# EAGLE schematic Sturingsschakeling_schema_v5.0 (EAGLE 9.7.0)
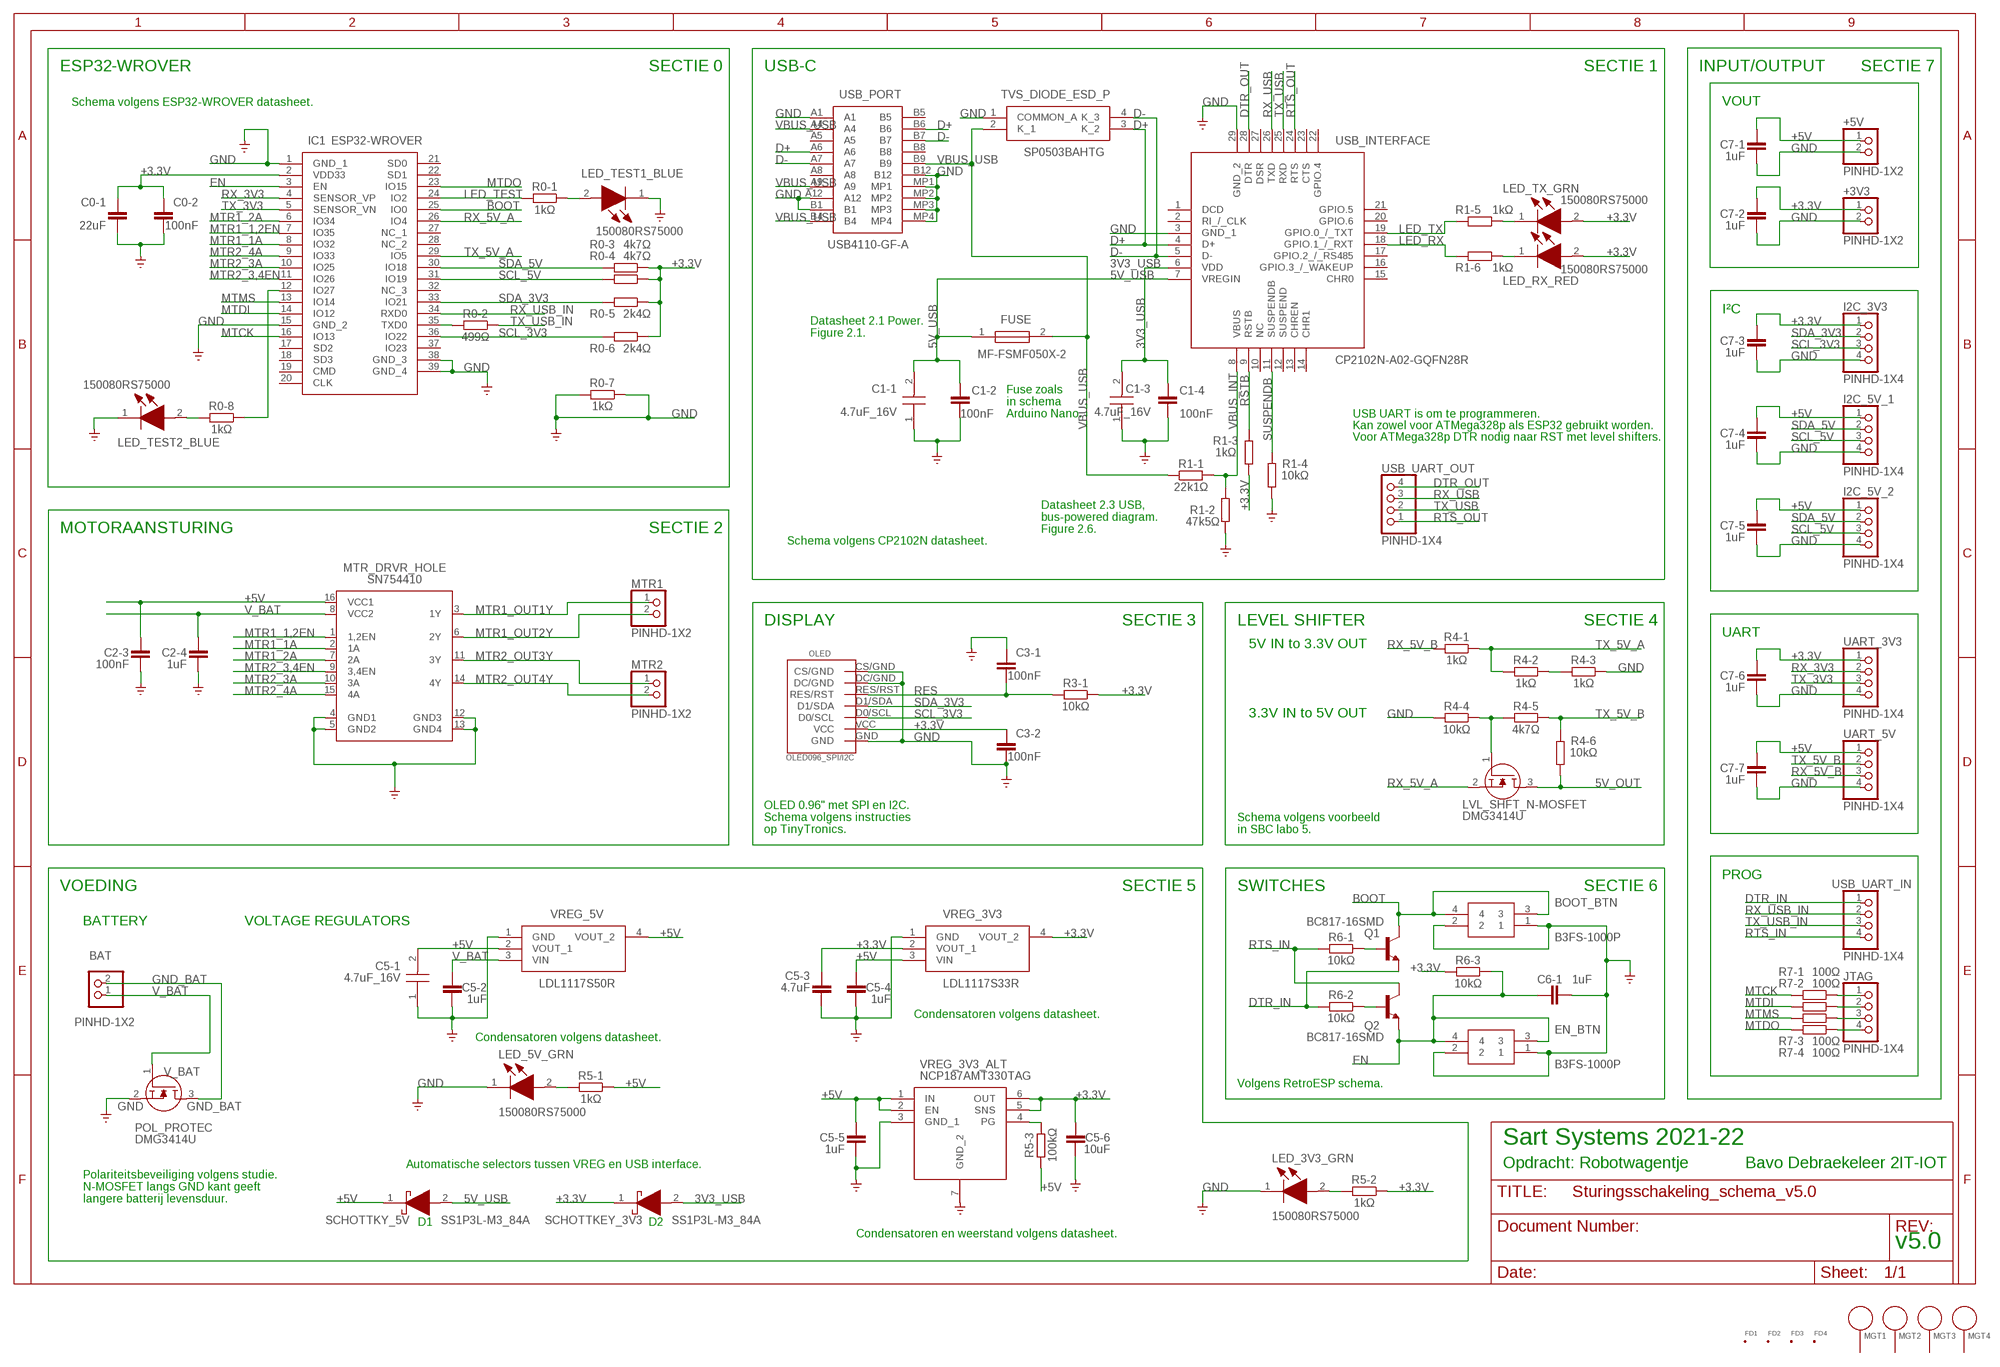
[diagram p0: schematic, sheet 1]

## Parts
+3V3  PINHD-1X2  [1X02]
+5V  PINHD-1X2  [1X02]
BAT  PINHD-1X2  [1X02]
BOOT_BTN  B3FS-1000P  [B3FS-1000P]
C0-1  22uF  C_CHIP-0805(2012-METRIC)  [CAPC2012X110]
C0-2  100nF  C_CHIP-0805(2012-METRIC)  [CAPC2012X110]
C1-1  4.7uF_16V  CC0805ZKY5V7BB475  [CAPC2012X145N]
C1-2  100nF  C_CHIP-0805(2012-METRIC)  [CAPC2012X110]
C1-3  4.7uF_16V  CC0805ZKY5V7BB475  [CAPC2012X145N]
C1-4  100nF  C_CHIP-0805(2012-METRIC)  [CAPC2012X110]
C2-3  100nF  C_CHIP-0805(2012-METRIC)  [CAPC2012X110]
C2-4  1uF  C_CHIP-0805(2012-METRIC)  [CAPC2012X110]
C3-1  100nF  C_CHIP-0805(2012-METRIC)  [CAPC2012X110]
C3-2  100nF  C_CHIP-0805(2012-METRIC)  [CAPC2012X110]
C5-1  4.7uF_16V  CC0805ZKY5V7BB475  [CAPC2012X145N]
C5-2  1uF  C_CHIP-0805(2012-METRIC)  [CAPC2012X110]
C5-3  4.7uF  C_CHIP-0805(2012-METRIC)  [CAPC2012X110]
C5-4  1uF  C_CHIP-0805(2012-METRIC)  [CAPC2012X110]
C5-5  1uF  C_CHIP-0805(2012-METRIC)  [CAPC2012X110]
C5-6  10uF  C_CHIP-0805(2012-METRIC)  [CAPC2012X110]
C6-1  1uF  C_CHIP-0805(2012-METRIC)  [CAPC2012X110]
C7-1  1uF  C_CHIP-0805(2012-METRIC)  [CAPC2012X110]
C7-2  1uF  C_CHIP-0805(2012-METRIC)  [CAPC2012X110]
C7-3  1uF  C_CHIP-0805(2012-METRIC)  [CAPC2012X110]
C7-4  1uF  C_CHIP-0805(2012-METRIC)  [CAPC2012X110]
C7-5  1uF  C_CHIP-0805(2012-METRIC)  [CAPC2012X110]
C7-6  1uF  C_CHIP-0805(2012-METRIC)  [CAPC2012X110]
C7-7  1uF  C_CHIP-0805(2012-METRIC)  [CAPC2012X110]
EN_BTN  B3FS-1000P  [B3FS-1000P]
FD1  FID_60MIL_P  [FID_060_P]
FD2  FID_60MIL_P  [FID_060_P]
FD3  FID_60MIL_P  [FID_060_P]
FD4  FID_60MIL_P  [FID_060_P]
FUSE  MF-FSMF050X-2  [FUSC1608X100N]
I2C_3V3  PINHD-1X4  [1X04]
I2C_5V_1  PINHD-1X4  [1X04]
I2C_5V_2  PINHD-1X4  [1X04]
IC1  ESP32-WROVER  [ESP32WROVER]
JTAG  PINHD-1X4  [1X04]
LED_3V3_GRN  150080RS75000  [LEDC2012X80N]
LED_5V_GRN  150080RS75000  [LEDC2012X80N]
LED_RX_RED  150080RS75000  [LEDC2012X80N]
LED_TEST1_BLUE  150080RS75000  [LEDC2012X80N]
LED_TEST2_BLUE  150080RS75000  [LEDC2012X80N]
LED_TX_GRN  150080RS75000  [LEDC2012X80N]
LVL_SHFT_N-MOSFET  DMG3414U  [SOT96P240X110-3N]
MGT1  BEAGLEBONEBLACK_MOUNTING_HOLE  [BEAGLEBONEBLACK_MOUNTING_HOLE]
MGT2  BEAGLEBONEBLACK_MOUNTING_HOLE  [BEAGLEBONEBLACK_MOUNTING_HOLE]
MGT3  BEAGLEBONEBLACK_MOUNTING_HOLE  [BEAGLEBONEBLACK_MOUNTING_HOLE]
MGT4  BEAGLEBONEBLACK_MOUNTING_HOLE  [BEAGLEBONEBLACK_MOUNTING_HOLE]
MTR1  PINHD-1X2  [1X02]
MTR2  PINHD-1X2  [1X02]
MTR_DRVR_HOLE  SN754410  [DIP762W53P254L1980H508Q16B]
OLED  OLED096_SPI/I2C  [OLED096_SPI/I2C]
POL_PROTEC  DMG3414U  [SOT96P240X110-3N]
Q1  BC817-16SMD  [SOT23-BEC]
Q2  BC817-16SMD  [SOT23-BEC]
R0-1  1kΩ  R_CHIP-0805(2012-METRIC)  [RESC2012X65]
R0-2  499Ω  R_CHIP-0805(2012-METRIC)  [RESC2012X65]
R0-3  4k7Ω  R_CHIP-0805(2012-METRIC)  [RESC2012X65]
R0-4  4k7Ω  R_CHIP-0805(2012-METRIC)  [RESC2012X65]
R0-5  2k4Ω  R_CHIP-0805(2012-METRIC)  [RESC2012X65]
R0-6  2k4Ω  R_CHIP-0805(2012-METRIC)  [RESC2012X65]
R0-7  1kΩ  R_CHIP-0805(2012-METRIC)  [RESC2012X65]
R0-8  1kΩ  R_CHIP-0805(2012-METRIC)  [RESC2012X65]
R1-1  22k1Ω  R_CHIP-0805(2012-METRIC)  [RESC2012X65]
R1-2  47k5Ω  R_CHIP-0805(2012-METRIC)  [RESC2012X65]
R1-3  1kΩ  R_CHIP-0805(2012-METRIC)  [RESC2012X65]
R1-4  10kΩ  R_CHIP-0805(2012-METRIC)  [RESC2012X65]
R1-5  1kΩ  R_CHIP-0805(2012-METRIC)  [RESC2012X65]
R1-6  1kΩ  R_CHIP-0805(2012-METRIC)  [RESC2012X65]
R3-1  10kΩ  R_CHIP-0805(2012-METRIC)  [RESC2012X65]
R4-1  1kΩ  R_CHIP-0805(2012-METRIC)  [RESC2012X65]
R4-2  1kΩ  R_CHIP-0805(2012-METRIC)  [RESC2012X65]
R4-3  1kΩ  R_CHIP-0805(2012-METRIC)  [RESC2012X65]
R4-4  10kΩ  R_CHIP-0805(2012-METRIC)  [RESC2012X65]
R4-5  4k7Ω  R_CHIP-0805(2012-METRIC)  [RESC2012X65]
R4-6  10kΩ  R_CHIP-0805(2012-METRIC)  [RESC2012X65]
R5-1  1kΩ  R_CHIP-0805(2012-METRIC)  [RESC2012X65]
R5-2  1kΩ  R_CHIP-0805(2012-METRIC)  [RESC2012X65]
R5-3  100kΩ  R_CHIP-0805(2012-METRIC)  [RESC2012X65]
R6-1  10kΩ  R_CHIP-0805(2012-METRIC)  [RESC2012X65]
R6-2  10kΩ  R_CHIP-0805(2012-METRIC)  [RESC2012X65]
R6-3  10kΩ  R_CHIP-0805(2012-METRIC)  [RESC2012X65]
R7-1  100Ω  R_CHIP-0805(2012-METRIC)  [RESC2012X65]
R7-2  100Ω  R_CHIP-0805(2012-METRIC)  [RESC2012X65]
R7-3  100Ω  R_CHIP-0805(2012-METRIC)  [RESC2012X65]
R7-4  100Ω  R_CHIP-0805(2012-METRIC)  [RESC2012X65]
SCHOTTKEY_3V3  SS1P3L-M3_84A  [SS1P3LM384A]
SCHOTTKY_5V  SS1P3L-M3_84A  [SS1P3LM384A]
TVS_DIODE_ESD_P  SP0503BAHTG  [SP0503BAHTG]
UART_3V3  PINHD-1X4  [1X04]
UART_5V  PINHD-1X4  [1X04]
USB_INTERFACE  CP2102N-A02-GQFN28R  [QFN50P500X500X80-29N]
USB_PORT  USB4110-GF-A  [USB4110GFA]
USB_UART_IN  PINHD-1X4  [1X04]
USB_UART_OUT  PINHD-1X4  [1X04]
VREG_3V3  LDL1117S33R  [SOT230P700X180-4N]
VREG_3V3_ALT  NCP187AMT330TAG  [SON65P200X200X80-7N]
VREG_5V  LDL1117S50R  [SOT230P700X180-4N]

## Nets
3V3_USB: C1-3.2 C1-4.2 SCHOTTKEY_3V3.2(A) USB_INTERFACE.6(VDD)
5V_OUT: LVL_SHFT_N-MOSFET.3(D) R4-6.2
5V_USB: C1-1.2 C1-2.2 FUSE.1 SCHOTTKY_5V.2(A) USB_INTERFACE.7(VREGIN)
+3.3V: +3V3.1 C0-1.2 C0-2.2 C3-2.2 C5-3.2 C5-6.2 C7-2.2 C7-3.2 C7-6.2 I2C_3V3.1 IC1.2(VDD33) LED_RX_RED.2(A) LED_TX_GRN.2(A) OLED.VCC R0-3.1 R0-4.1 R0-5.1 R0-6.1 R1-3.2 R3-1.1 R5-2.1 R6-3.2 SCHOTTKEY_3V3.1(K) UART_3V3.1 VREG_3V3.2(VOUT_1) VREG_3V3.4(VOUT_2) VREG_3V3_ALT.5(SNS) VREG_3V3_ALT.6(OUT)
+5V: +5V.1 C2-3.2 C5-1.2 C5-4.2 C5-5.2 C7-1.2 C7-4.2 C7-5.2 C7-7.2 I2C_5V_1.1 I2C_5V_2.1 MTR_DRVR_HOLE.16(VCC1) R5-1.1 R5-3.2 SCHOTTKY_5V.1(K) UART_5V.1 VREG_3V3.3(VIN) VREG_3V3_ALT.1(IN) VREG_3V3_ALT.2(EN) VREG_5V.2(VOUT_1) VREG_5V.4(VOUT_2)
BOOT: BOOT_BTN.3 BOOT_BTN.4 IC1.25(IO0) Q1.C
D+: TVS_DIODE_ESD_P.3(K_2) USB_INTERFACE.4(D+) USB_PORT.A6 USB_PORT.B6
D-: TVS_DIODE_ESD_P.4(K_3) USB_INTERFACE.5(D-) USB_PORT.A7 USB_PORT.B7
DTR_IN: Q1.E R6-2.2 USB_UART_IN.1
DTR_OUT: USB_INTERFACE.28(DTR) USB_UART_OUT.4
EN: C6-1.2 EN_BTN.3 EN_BTN.4 IC1.3(EN) Q2.E R6-3.1
GND: +3V3.2 +5V.2 BOOT_BTN.1 BOOT_BTN.2 C0-1.1 C0-2.1 C1-1.1 C1-2.1 C1-3.1 C1-4.1 C2-3.1 C2-4.1 C3-1.2 C3-2.1 C5-1.1 C5-2.1 C5-3.1 C5-4.1 C5-5.1 C5-6.1 C6-1.1 C7-1.1 C7-2.1 C7-3.1 C7-4.1 C7-5.1 C7-6.1 C7-7.1 EN_BTN.1 EN_BTN.2 I2C_3V3.4 I2C_5V_1.4 I2C_5V_2.4 IC1.1(GND_1) IC1.15(GND_2) IC1.38(GND_3) IC1.39(GND_4) LED_3V3_GRN.1(K) LED_5V_GRN.1(K) LED_TEST1_BLUE.1(K) LED_TEST2_BLUE.1(K) MTR_DRVR_HOLE.4(GND1) MTR_DRVR_HOLE.5(GND2) MTR_DRVR_HOLE.12(GND3) MTR_DRVR_HOLE.13(GND4) OLED.CS/GND OLED.DC/GND OLED.GND POL_PROTEC.2(S) R0-7.1 R0-7.2 R1-2.1 R1-4.1 R4-3.1 R4-4.2 TVS_DIODE_ESD_P.1(COMMON_A) UART_3V3.4 UART_5V.4 USB_INTERFACE.3(GND_1) USB_INTERFACE.29(GND_2) USB_PORT.A1 USB_PORT.A12 USB_PORT.B1 USB_PORT.B12 USB_PORT.MP1 USB_PORT.MP2 USB_PORT.MP3 USB_PORT.MP4 VREG_3V3.1(GND) VREG_3V3_ALT.3(GND_1) VREG_3V3_ALT.7(GND_2) VREG_5V.1(GND) ; supply symbol labelled SUPPLY0_GND_
GND_BAT: BAT.2 POL_PROTEC.3(D)
LED_RX: R1-6.2 USB_INTERFACE.18(GPIO.1_/_RXT)
LED_TEST: IC1.24(IO2) R0-1.2
LED_TX: R1-5.2 USB_INTERFACE.19(GPIO.0_/_TXT)
MTCK: IC1.16(IO13) R7-1.2
MTDI: IC1.14(IO12) R7-2.2
MTDO: IC1.23(IO15) R7-4.2
MTMS: IC1.13(IO14) R7-3.2
MTR1_1,2EN: IC1.7(IO35) MTR_DRVR_HOLE.1(1,2EN)
MTR1_1A: IC1.8(IO32) MTR_DRVR_HOLE.2(1A)
MTR1_2A: IC1.6(IO34) MTR_DRVR_HOLE.7(2A)
MTR1_OUT1Y: MTR1.1 MTR_DRVR_HOLE.3(1Y)
MTR1_OUT2Y: MTR1.2 MTR_DRVR_HOLE.6(2Y)
MTR2_3,4EN: IC1.11(IO26) MTR_DRVR_HOLE.9(3,4EN)
MTR2_3A: IC1.10(IO25) MTR_DRVR_HOLE.10(3A)
MTR2_4A: IC1.9(IO33) MTR_DRVR_HOLE.15(4A)
MTR2_OUT3Y: MTR2.1 MTR_DRVR_HOLE.11(3Y)
MTR2_OUT4Y: MTR2.2 MTR_DRVR_HOLE.14(4Y)
N$2: IC1.12(IO27) R0-8.1
N$3: LED_TEST2_BLUE.2(A) R0-8.2
N$6: JTAG.1 R7-1.1
N$7: LED_3V3_GRN.2(A) R5-2.2
N$8: LED_5V_GRN.2(A) R5-1.2
N$10: LED_TEST1_BLUE.2(A) R0-1.1
N$11: JTAG.2 R7-2.1
N$13: R5-3.1 VREG_3V3_ALT.4(PG)
N$14: JTAG.3 R7-3.1
N$15: JTAG.4 R7-4.1
N$18: Q1.B R6-1.1
N$19: Q2.B R6-2.1
N$34: LVL_SHFT_N-MOSFET.1(G) R4-4.1 R4-5.2
N$35: R4-2.1 R4-3.2
N$38: IC1.35(TXD0) R0-2.2
N$40: LED_TX_GRN.1(K) R1-5.1
N$41: LED_RX_RED.1(K) R1-6.1
RES: C3-1.1 OLED.RES/RST R3-1.2
RSTB: R1-3.1 USB_INTERFACE.9(RSTB)
RTS_IN: Q2.C R6-1.2 USB_UART_IN.4
RTS_OUT: USB_INTERFACE.24(RTS) USB_UART_OUT.1
RX_3V3: IC1.4(SENSOR_VP) UART_3V3.2
RX_5V_A: IC1.26(IO4) LVL_SHFT_N-MOSFET.2(S)
RX_5V_B: R4-1.2 UART_5V.3
RX_USB: USB_INTERFACE.26(TXD) USB_UART_OUT.3
RX_USB_IN: IC1.34(RXD0) USB_UART_IN.2
SCL_3V3: I2C_3V3.3 IC1.36(IO22) OLED.D0/SCL R0-6.2
SCL_5V: I2C_5V_1.3 I2C_5V_2.3 IC1.31(IO19) R0-4.2
SDA_3V3: I2C_3V3.2 IC1.33(IO21) OLED.D1/SDA R0-5.2
SDA_5V: I2C_5V_1.2 I2C_5V_2.2 IC1.30(IO18) R0-3.2
SUSPENDB: R1-4.2 USB_INTERFACE.11(SUSPENDB)
TX_3V3: IC1.5(SENSOR_VN) UART_3V3.3
TX_5V_A: IC1.29(IO5) R4-1.1 R4-2.2
TX_5V_B: R4-5.1 R4-6.1 UART_5V.2
TX_USB: USB_INTERFACE.25(RXD) USB_UART_OUT.2
TX_USB_IN: R0-2.1 USB_UART_IN.3
V_BAT: BAT.1 C2-4.2 C5-2.2 MTR_DRVR_HOLE.8(VCC2) POL_PROTEC.1(G) VREG_5V.3(VIN)
VBUS_INT: R1-1.2 R1-2.2 USB_INTERFACE.8(VBUS)
VBUS_USB: FUSE.2 R1-1.1 TVS_DIODE_ESD_P.2(K_1) USB_PORT.A4 USB_PORT.A9 USB_PORT.B4 USB_PORT.B9
Unconnected: IC1.17(SD2) IC1.18(SD3) IC1.19(CMD) IC1.20(CLK) IC1.21(SD0) IC1.22(SD1) IC1.27(NC_1) IC1.28(NC_2) IC1.32(NC_3) IC1.37(IO23) MGT1.P$1 MGT2.P$1 MGT3.P$1 MGT4.P$1 USB_INTERFACE.1(DCD) USB_INTERFACE.2(RI_/_CLK) USB_INTERFACE.10(NC) USB_INTERFACE.12(SUSPEND) USB_INTERFACE.13(CHREN) USB_INTERFACE.14(CHR1) USB_INTERFACE.15(CHR0) USB_INTERFACE.16(GPIO.3_/_WAKEUP) USB_INTERFACE.17(GPIO.2_/_RS485) USB_INTERFACE.20(GPIO.6) USB_INTERFACE.21(GPIO.5) USB_INTERFACE.22(GPIO.4) USB_INTERFACE.23(CTS) USB_INTERFACE.27(DSR) USB_PORT.A5 USB_PORT.A8 USB_PORT.B5 USB_PORT.B8

## Notes on the sheet
- ESP32-WROVER | SECTIE 0 | USB-C | SECTIE 1 | INPUT/OUTPUT | SECTIE 7
- Schema volgens ESP32-WROVER datasheet. | VOUT
- I²C
- Datasheet 2.1 Power.
  Figure 2.1.
- Fuse zoals
  in schema
  Arduino Nano.
- USB UART is om te programmeren.
- Kan zowel voor ATMega328p als ESP32 gebruikt worden.
- Voor ATMega328p DTR nodig naar RST met level shifters.
- MOTORAANSTURING | SECTIE 2
- Datasheet 2.3 USB,
  bus-powered diagram.
  Figure 2.6.
- Schema volgens CP2102N datasheet.
- DISPLAY | SECTIE 3 | LEVEL SHIFTER | SECTIE 4
- UART
- 5V IN to 3.3V OUT
- 3.3V IN to 5V OUT
- OLED 0.96" met SPI en I2C.
  Schema volgens instructies
  op TinyTronics.
- Schema volgens voorbeeld 
  in SBC labo 5.
- PROG
- VOEDING | SECTIE 5 | SWITCHES | SECTIE 6
- BATTERY | VOLTAGE REGULATORS
- Condensatoren volgens datasheet.
- Condensatoren volgens datasheet.
- Volgens RetroESP schema.
- Sart Systems 2021-22
- Automatische selectors tussen VREG en USB interface. | Opdracht: Robotwagentje | Bavo Debraekeleer 2IT-IOT
- Polariteitsbeveiliging volgens studie.
  N-MOSFET langs GND kant geeft 
  langere batterij levensduur.
- D1 | D2
- Condensatoren en weerstand volgens datasheet.
- v5.0

## Library data of the parts
+3V3 +5V BAT MTR1 MTR2 = Connector:PINHD-1X2: PIN HEADER; CATEGORY: CONNECTOR; SUB-CATEGORY: PIN-HEADER
BOOT_BTN EN_BTN = B3FS-1000P:B3FS-1000P: Switch Tact,6x6mm,flat act,gen purp,tape Plunger Tactile Switch, SPST-NO 0.05 A@ 24 V dc 0.5mm Source: Datasheet <https://www.omron.co.jp/ecb/products/pdf/b3fs.pdf>; ARROW_PART_NUMBER: B3FS-1000P; ARROW_PRICE-STOCK: https://www.arrow.com/en/products/b3fs-1000p/omron?region=nac; DESCRIPTION: Switch Tact,6x6mm,flat act,gen purp,tape Plunger Tactile Switch, SPST-NO 0.05 A@ 24 V dc 0.5mm; HEIGHT: mm; MANUFACTURER_NAME: Omron Electronics; MANUFACTURER_PART_NUMBER: B3FS-1000P; MOUSER_PART_NUMBER: 653-B3FS-1000P; MOUSER_PRICE-STOCK: https://www.mouser.co.uk/ProductDetail/Omron-Electronics/B3FS-1000P?qs=ImaqFqjHA4k6odVF2%2FXWpQ%3D%3D
C0-1 C0-2 C1-2 C1-4 C2-3 C2-4 C3-1 C3-2 C5-2-C5-6 C6-1 C7-1-C7-7 = Capacitor:C: Capacitor - Generic; CATEGORY: Capacitor
C1-1 C1-3 C5-1 = CC0805ZKY5V7BB475:CC0805ZKY5V7BB475: YAGEO - CC0805ZKY5V7BB475 - SMD Multilayer Ceramic Capacitor, 4.7 F, 16 V, 0805 [2012 Metric], +80%, -20%, Y5V, CC Series Source: Datasheet <https://4donline.ihs.com/images/VipMasterIC/IC/YAGO/YAGO-S-A0004841839/YAGO-S-A0004841839-1.pdf?hkey=6D3A4C79FDBF58556ACFDE234799DDF0>; ARROW_PART_NUMBER: CC0805ZKY5V7BB475; ARROW_PRICE-STOCK: https://www.arrow.com/en/products/cc0805zky5v7bb475/yageo; DESCRIPTION: YAGEO - CC0805ZKY5V7BB475 - SMD Multilayer Ceramic Capacitor, 4.7 F, 16 V, 0805 [2012 Metric], +80%, -20%, Y5V, CC Series; HEIGHT: 1.45mm; MANUFACTURER_NAME: KEMET; MANUFACTURER_PART_NUMBER: CC0805ZKY5V7BB475; MOUSER_PART_NUMBER: 603-CC805ZKY5V7BB475; MOUSER_PRICE-STOCK: https://www.mouser.co.uk/ProductDetail/Yageo/CC0805ZKY5V7BB475?qs=7s%252B3O6pAiyA4wtTM471wUA%3D%3D
FD1-FD4 = Fiducial:FID: Fiducial marks. Top and Bottom copper with stop mask
FUSE = MF-FSMF050X-2:MF-FSMF050X-2: 0603 PTC Resettable Fuses, 6V, 500mA Bourns 0.5A Surface Mount Resettable Fuse, 6 V Source: Datasheet <http://uk.rs-online.com/web/p/products/6927633>; ARROW_PART_NUMBER: MF-FSMF050X-2; ARROW_PRICE-STOCK: https://www.arrow.com/en/products/mf-fsmf050x-2/bourns?region=nac; DESCRIPTION: 0603 PTC Resettable Fuses, 6V, 500mA Bourns 0.5A Surface Mount Resettable Fuse, 6 V; HEIGHT: 1mm; MANUFACTURER_NAME: Bourns; MANUFACTURER_PART_NUMBER: MF-FSMF050X-2; MOUSER_PART_NUMBER: 652-MFFSMF050X-2; MOUSER_PRICE-STOCK: https://www.mouser.co.uk/ProductDetail/Bourns/MF-FSMF050X-2?qs=3QkGRBNOvbrZekaW8Gqm4A%3D%3D
I2C_3V3 I2C_5V_1 I2C_5V_2 JTAG UART_3V3 UART_5V USB_UART_IN USB_UART_OUT = Connector:PINHD-1X4: PIN HEADER; CATEGORY: CONNECTOR; SUB-CATEGORY: PIN-HEADER
IC1 = ESP32-WROVER:ESP32-WROVER: WiFi Modules (802.11) SMD Module, ESP32-D0WDQ6, 64Mbits PSRAM, 32Mbits SPI flash, PCB Antenna Source: Datasheet <https://www.mouser.it/datasheet/2/891/esp32-wrover_datasheet_en-1223875.pdf>; DESCRIPTION: WiFi Modules (802.11) SMD Module, ESP32-D0WDQ6, 64Mbits PSRAM, 32Mbits SPI flash, PCB Antenna; HEIGHT: 3mm; MANUFACTURER_NAME: Espressif Systems; MANUFACTURER_PART_NUMBER: ESP32-WROVER; MOUSER_PART_NUMBER: 356-ESP32-WROVER
LED_3V3_GRN LED_5V_GRN LED_RX_RED LED_TEST1_BLUE LED_TEST2_BLUE LED_TX_GRN = 150080RS75000:150080RS75000: LED,Wurth Elektronik,150080RS75000 Wurth Elektronik 150080RS75000, WL-SMCW Series Red LED, 625 nm 2012 (0805) Clear, Rectangle Lens SMD package Source: Datasheet <https://componentsearchengine.com/Datasheets/2/150080RS75000.pdf>; DESCRIPTION: LED,Wurth Elektronik,150080RS75000 Wurth Elektronik 150080RS75000, WL-SMCW Series Red LED, 625 nm 2012 (0805) Clear, Rectangle Lens SMD package; HEIGHT: 0.8mm; MANUFACTURER_NAME: Wurth Elektronik; MANUFACTURER_PART_NUMBER: 150080RS75000; MOUSER_PART_NUMBER: 710-150080RS75000; MOUSER_PRICE-STOCK: https://www.mouser.co.uk/ProductDetail/Wurth-Elektronik/150080RS75000?qs=LlUlMxKIyB2jdCo7bnfgew%3D%3D
LVL_SHFT_N-MOSFET POL_PROTEC = DMG3414U:DMG3414U: DIODES INC. - DMG3414U - MOSFET, N CH, W DIODE, 20V, 4.2A, SOT23 Source: Datasheet <https://componentsearchengine.com/Datasheets/2/DMG3414U.pdf>; DESCRIPTION: DIODES INC. - DMG3414U - MOSFET, N CH, W DIODE, 20V, 4.2A, SOT23; HEIGHT: 1.1mm; MANUFACTURER_NAME: Diodes Inc.; MANUFACTURER_PART_NUMBER: DMG3414U; MOUSER_PART_NUMBER: N/A; MOUSER_PRICE-STOCK: https://www.mouser.co.uk/ProductDetail/Diodes-Incorporated/DMG3414U?qs=Ledwo0gu0jiKJ4xsXSUnyQ%3D%3D
MGT1-MGT4 = BeagleBone_Black_Wireless:BEAGLEBONEBLACK_MOUNTING_HOLE: Chassis Mounting Hole w/GND connection ability
MTR_DRVR_HOLE = IC_Power-Management:SN754410: Quadruple Half-H Driver Datasheet <https://www.ti.com/lit/ds/symlink/sn754410.pdf?ts=1613019217967&ref_url=https%253A%252F%252Fwww.ti.com%252Fproduct%252FSN754410%253Fqgpn%253Dsn754410>; CATEGORY: IC_Power-Management; DESCRIPTION: Quadruple Half-H Driver; MANUFACTURER: TEXAS INSTRUMENTS; MPN: SN754410; OPERATING_TEMP: -40°C to 150°C (TJ); PART_STATUS: Active; ROHS_COMPLIANT: ROHS3 Compliant; SERIES: SN754; SUB_CATEGORY: Motor Driver
OLED = OLED096:OLED096_SPI/I2C
Q1 Q2 = transistor-npn:BC817*: NPN Transistor
R0-1-R0-8 R1-1-R1-6 R3-1 R4-1-R4-6 R5-1-R5-3 R6-1-R6-3 R7-1-R7-4 = Resistor:R: Resistor Fixed - Generic; CATEGORY: Resistor; SUB-CATEGORY: Fixed
SCHOTTKEY_3V3 SCHOTTKY_5V = SS1P3L-M3_84A:SS1P3L-M3_84A: Schottky Diodes & Rectifiers 30volt 1.0amp Low VF High Current Density Surface Mount Schottky Barrier Rectifiers Source: Datasheet <https://ms.componentsearchengine.com/Datasheets/2/SS1P3L-M3_84A.pdf>; ARROW_PART_NUMBER: SS1P3L-M3/84A; ARROW_PRICE-STOCK: https://www.arrow.com/en/products/ss1p3l-m384a/vishay?region=nac; DESCRIPTION: Schottky Diodes & Rectifiers 30volt 1.0amp Low VF High Current Density Surface Mount Schottky Barrier Rectifiers; HEIGHT: 1.15mm; MANUFACTURER_NAME: Vishay; MANUFACTURER_PART_NUMBER: SS1P3L-M3/84A; MOUSER_PART_NUMBER: 625-SS1P3L-M3/84A; MOUSER_PRICE-STOCK: https://www.mouser.co.uk/ProductDetail/Vishay-General-Semiconductor/SS1P3L-M3-84A?qs=HSPD0Bff7iZtYrbeCvAZDQ%3D%3D
TVS_DIODE_ESD_P = SP0503BAHTG:SP0503BAHTG: ESD Suppressors / TVS Diodes TVS AVAL DIODE SMT Source: Datasheet <https://nl.mouser.com/datasheet/2/240/Littelfuse_TVS_Diode_Array_SP05_Datasheet.pdf-777043.pdf>; ARROW_PART_NUMBER: SP0503BAHTG; ARROW_PRICE-STOCK: https://www.arrow.com/en/products/sp0503bahtg/littelfuse?region=europe; DESCRIPTION: ESD Suppressors / TVS Diodes TVS AVAL DIODE SMT; HEIGHT: 1.22mm; MANUFACTURER_NAME: LITTELFUSE; MANUFACTURER_PART_NUMBER: SP0503BAHTG; MOUSER_PART_NUMBER: 576-SP0503BAHTG; MOUSER_PRICE-STOCK: https://www.mouser.co.uk/ProductDetail/Littelfuse/SP0503BAHTG?qs=uD%2FdkN7XIa0NTYXwHdELYA%3D%3D
USB_INTERFACE = CP2102N-A02-GQFN28R:CP2102N-A02-GQFN28R: USB Interface IC USB to UART bridge - QFN28 Source: Datasheet <https://www.silabs.com/documents/public/data-sheets/cp2102n-datasheet.pdf>; ARROW_PART_NUMBER: CP2102N-A02-GQFN28R; ARROW_PRICE-STOCK: https://www.arrow.com/en/products/cp2102n-a02-gqfn28r/silicon-labs?region=nac; DESCRIPTION: USB Interface IC USB to UART bridge - QFN28; HEIGHT: 0.8mm; MANUFACTURER_NAME: Silicon Labs; MANUFACTURER_PART_NUMBER: CP2102N-A02-GQFN28R; MOUSER_PART_NUMBER: 634-CP2102NA02QFN28R; MOUSER_PRICE-STOCK: https://www.mouser.co.uk/ProductDetail/Silicon-Labs/CP2102N-A02-GQFN28R?qs=u16ybLDytRag4qKvSH3fTw%3D%3D
USB_PORT = USB4110-GF-A:USB4110-GF-A: CONN USB 2.0 TYPE-C R/A SMT Source: Datasheet <https://gct.co/files/drawings/usb4110.pdf>; DESCRIPTION: CONN USB 2.0 TYPE-C R/A SMT; HEIGHT: 3.26mm; MANUFACTURER_NAME: GCT (GLOBAL CONNECTOR TECHNOLOGY); MANUFACTURER_PART_NUMBER: USB4110-GF-A; MOUSER_PART_NUMBER: 640-USB4110-GF-A; MOUSER_PRICE-STOCK: https://www.mouser.co.uk/ProductDetail/GCT/USB4110-GF-A?qs=KUoIvG%2F9IlYiZvIXQjyJeA%3D%3D
VREG_3V3 = LDL1117S33R:LDL1117S33R: STMICROELECTRONICS - LDL1117S33R - LDO, FIXED, 3.3V, 1.2A, SOT-223-3 Source: Datasheet <https://componentsearchengine.com/Datasheets/2/LDL1117S33R.pdf>; ARROW_PART_NUMBER: LDL1117S33R; ARROW_PRICE-STOCK: https://www.arrow.com/en/products/ldl1117s33r/stmicroelectronics?region=nac; DESCRIPTION: STMICROELECTRONICS - LDL1117S33R - LDO, FIXED, 3.3V, 1.2A, SOT-223-3; HEIGHT: 1.8mm; MANUFACTURER_NAME: STMicroelectronics; MANUFACTURER_PART_NUMBER: LDL1117S33R; MOUSER_PART_NUMBER: 511-LDL1117S33R; MOUSER_PRICE-STOCK: https://www.mouser.co.uk/ProductDetail/STMicroelectronics/LDL1117S33R?qs=AQlKX63v8Rt9Bf6AWSrbFg%3D%3D
VREG_3V3_ALT = NCP187AMT330TAG:NCP187AMT330TAG: LDO Voltage Regulators 1.2A 3.3V Active discharge Source: Datasheet <https://componentsearchengine.com/Datasheets/1/NCP187AMT330TAG.pdf>; ARROW_PART_NUMBER: NCP187AMT330TAG; ARROW_PRICE-STOCK: https://www.arrow.com/en/products/ncp187amt330tag/on-semiconductor?region=nac; DESCRIPTION: LDO Voltage Regulators 1.2A 3.3V Active discharge; HEIGHT: 0.8mm; MANUFACTURER_NAME: onsemi; MANUFACTURER_PART_NUMBER: NCP187AMT330TAG; MOUSER_PART_NUMBER: 863-NCP187AMT330TAG; MOUSER_PRICE-STOCK: https://www.mouser.co.uk/ProductDetail/ON-Semiconductor/NCP187AMT330TAG?qs=%252B6g0mu59x7JOII%252BWk4iw4Q%3D%3D
VREG_5V = LDL1117S50R:LDL1117S50R: STMICROELECTRONICS - LDL1117S50R - LDO, FIXED, 5V, 1.2A, SOT-223-3 Source: Datasheet <http://www.farnell.com/datasheets/2259188.pdf>; ARROW_PART_NUMBER: LDL1117S50R; ARROW_PRICE-STOCK: https://www.arrow.com/en/products/ldl1117s50r/stmicroelectronics?region=nac; DESCRIPTION: STMICROELECTRONICS - LDL1117S50R - LDO, FIXED, 5V, 1.2A, SOT-223-3; HEIGHT: 1.8mm; MANUFACTURER_NAME: STMicroelectronics; MANUFACTURER_PART_NUMBER: LDL1117S50R; MOUSER_PART_NUMBER: 511-LDL1117S50R; MOUSER_PRICE-STOCK: https://www.mouser.co.uk/ProductDetail/STMicroelectronics/LDL1117S50R?qs=AQlKX63v8RsuN9BQFiVf%2Fg%3D%3D